# Altium schematic sheet BLE-nRF52832.SchDoc
size A
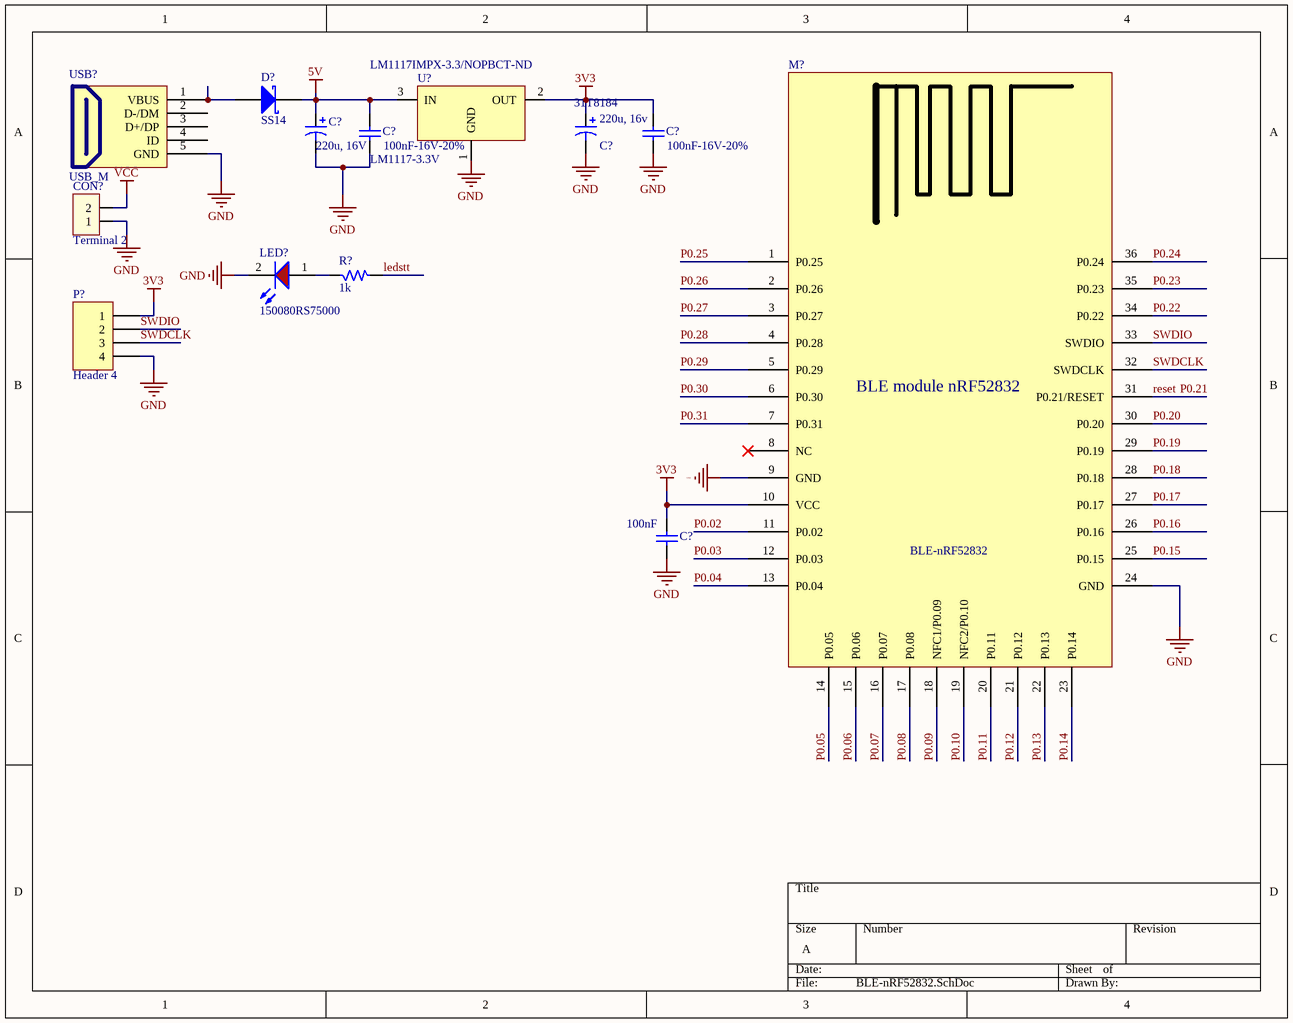
[diagram p0: BLE-nRF52832.SchDoc]

## Parts
(Parts that share a designator on the sheet are numbered #1, #2 ... from top to bottom, then left to right.)
C?#1  value 220u, 16V  [CAP TANTALUM 7343]  (hidden comment: Cap Pol3)
C?#2  100nF-16V-20%  [C0805]
C?#3  220u, 16v  Supplier Part Number 1: 31T8184  [CAP TANTALUM 7343]
C?#4  100nF-16V-20%  [C0805]
C?#5  100nF  [C0805]
CON?  Terminal 2  [Terminal 2 5.08]
D?  SS14  [DO-214AC (SMA)]
LED?  150080RS75000  [LED_0805_Red]
M?  BLE-nRF52832  [BLE-nRF52832 - SMD]
P?  Header 4  [HDR1X4]
R?  1k  [R0805]
U?  LM1117-3.3V  Supplier Part Number 1: LM1117IMPX-3.3/NOPBCT-ND  [LM1117-SOP]
USB?  USB_M  [USB_B_MINI_SMD]

## Nets
3V3: C?#3.1 C?#4.1 C?#5.1 M?.10(VCC) P?.1 U?.2(OUT)
5V: C?#1.1 C?#2.1 D?.2(K) U?.3(IN)
GND: C?#1.2 C?#2.2 C?#3.2 C?#4.2 C?#5.2 CON?.1 LED?.2(C) M?.9(GND) M?.24(GND) P?.4 U?.1(GND) USB?.5(GND)
VCC: CON?.2
ledstt: R?.2
P0.02: M?.11(P0.02)
P0.03: M?.12(P0.03)
P0.04: M?.13(P0.04)
P0.05: M?.14(P0.05)
P0.06: M?.15(P0.06)
P0.07: M?.16(P0.07)
P0.08: M?.17(P0.08)
P0.09: M?.18(NFC1/P0.09)
P0.10: M?.19(NFC2/P0.10)
P0.11: M?.20(P0.11)
P0.12: M?.21(P0.12)
P0.13: M?.22(P0.13)
P0.14: M?.23(P0.14)
P0.15: M?.25(P0.15)
P0.16: M?.26(P0.16)
P0.17: M?.27(P0.17)
P0.18: M?.28(P0.18)
P0.19: M?.29(P0.19)
P0.20: M?.30(P0.20)
P0.21: M?.31(P0.21/RESET)  [also labelled reset]
P0.22: M?.34(P0.22)
P0.23: M?.35(P0.23)
P0.24: M?.36(P0.24)
P0.25: M?.1(P0.25)
P0.26: M?.2(P0.26)
P0.27: M?.3(P0.27)
P0.28: M?.4(P0.28)
P0.29: M?.5(P0.29)
P0.30: M?.6(P0.30)
P0.31: M?.7(P0.31)
SWDCLK: M?.32(SWDCLK) P?.3
SWDIO: M?.33(SWDIO) P?.2
NetD?_1: D?.1(A) USB?.1(VBUS)
NetLED?_1: LED?.1(A) R?.1

Not connected (* = marked no-connect by the designer): M? 8(NC)*; USB? 2(D-/DM) 3(D+/DP) 4(ID)

## Library data of the parts
C?#1 = Cap Pol3: Polarized Capacitor (Surface Mount); Manufacturer: Kemet; Manufacturer Part Number: C0603C103K5RACTU; Capacitance: 10000pF; Voltage - Rated: 50V; Tolerance: ±10%; Temperature Coefficient: X7R; Published: 8-Jun-2000; LatestRevisionDate: 29-May-2009; LatestRevisionNote: IPC-7351 Footprint Added.; PackageReference: C0805; Publisher: Altium Limited; PackageDescription: Chip Capacitor; Supplier 1: Digi-Key; Supplier Part Number 1: 399-1091-1-ND; RoHS: RoHS Compliant; Category: Capacitors; Stock 1: 1592048; Pricing 1: 1=0.1, 10=0.019, 50=0.0104, 100=0.0088, 250=0.0072, 500=0.00616, 1000=0.0048 (USD); Packaging: Cut Tape (CT); Mounting Type: Surface Mount, MLCC; Operating Temperature: -55°C ~ 125°C; Applications: General Purpose; Ratings: -; Package/Case: 0603 (1608 Metric); Size / Dimension: 0.063" L x 0.031" W (1.60mm x 0.80mm); Height - Seated (Max): -; Thickness (Max): 0.034" (0.87mm); Lead Spacing: -; Features: -; Lead Style: -; ComponentLink1URL: http://www.kemet.com/datasheets&C0603C103K5RACTU; ComponentLink1Description: http://www.kemet.com/datasheets&C0603C103K5RACTU; Supplier 2: Digi-Key; Supplier Part Number 2: 587-2994-1-ND; Stock 2: 102954; Pricing 2: 1=0.28, 10=0.19, 50=0.115, 100=0.0966, 250=0.0782, 500=0.069, 1000=0.05865 (USD); ComponentLink2URL: http://www.yuden.co.jp/or/product/category/capacitor/UMK316AB7475KL-T.pdf; ComponentLink2Description: http://www.yuden.co.jp/or/product/category/capacitor/UMK316AB7475KL-T.pdf
C?#2 C?#4 C?#5 = Cap: CAP CER 0.1UF 16V Y5V 0603; Manufacturer: Yageo; Manufacturer Part Number: CC0603ZRY5V7BB104; Published: 8-Jun-2000; LatestRevisionDate: 17-Jul-2002; LatestRevisionNote: Re-released for DXP Platform.; PackageReference: C0603; Publisher: Altium Limited; Digi-Key Part Number: 311-1369-1-ND; Unit Price: 0.00648
  C?#2 C?#4: Value: 100nF-16V-20%
  C?#5: Value: 100nF
C?#3 = Cap Pol3: Polarized Capacitor (Surface Mount); Published: 8-Jun-2000; LatestRevisionDate: 29-May-2009; LatestRevisionNote: IPC-7351 Footprint Added.; PackageReference: C0805; Publisher: Altium Limited; PackageDescription: Chip Capacitor; Supplier 1: Newark
CON? = Terminal 2: Value: Connector 2
D? = D Schottky: Schottky Diode; Published: 8-Jun-2000; LatestRevisionDate: 17-Jul-2002; LatestRevisionNote: Re-released for DXP Platform.; PackageReference: SMB; Publisher: Altium Limited; Code_JEDEC: DO-214-AA
LED? = led-0805: SMD mono-color Chip LED, WL-SMCW, Red; Manufacturer: W黵th Elektronik eiSos GmbH; PartNo: 150080RS75000; ComponentLink1Description: Manufacturer; ComponentLink1URL: http://www.we-online.de; Created by: Christin Otto; Created Date: June 2013; ComponentLink2Description: Datasheet; ComponentLink2URL: http://katalog.we-online.com/led/datasheet/150080RS75000.pdf; Color: Red
M? = BLE-nRF52832: BLE module nRF52832
P? = Header 4: Header, 4-Pin; LatestRevisionDate: 17-Jul-2002; LatestRevisionNote: Re-released for DXP Platform.; Publisher: Altium Limited
R? = RM: Resistor SMD; Manufacturer No: RM10JTN102; Manufacturer: UniOhm; Power Rating: 1/10W; Value: 1k; Specification: ="Value" + "  "+ "Power Rating"
U? = LM1117: 800mA Low-Dropout Linear Regulator; Creator: Nguyen Ba Bien; Website: http://group3i.net; Supplier 1: Digi-Key